# EasyEDA schematic SCH_ESP8266_2025-01-11.json

## Sheets
1 ESP8266
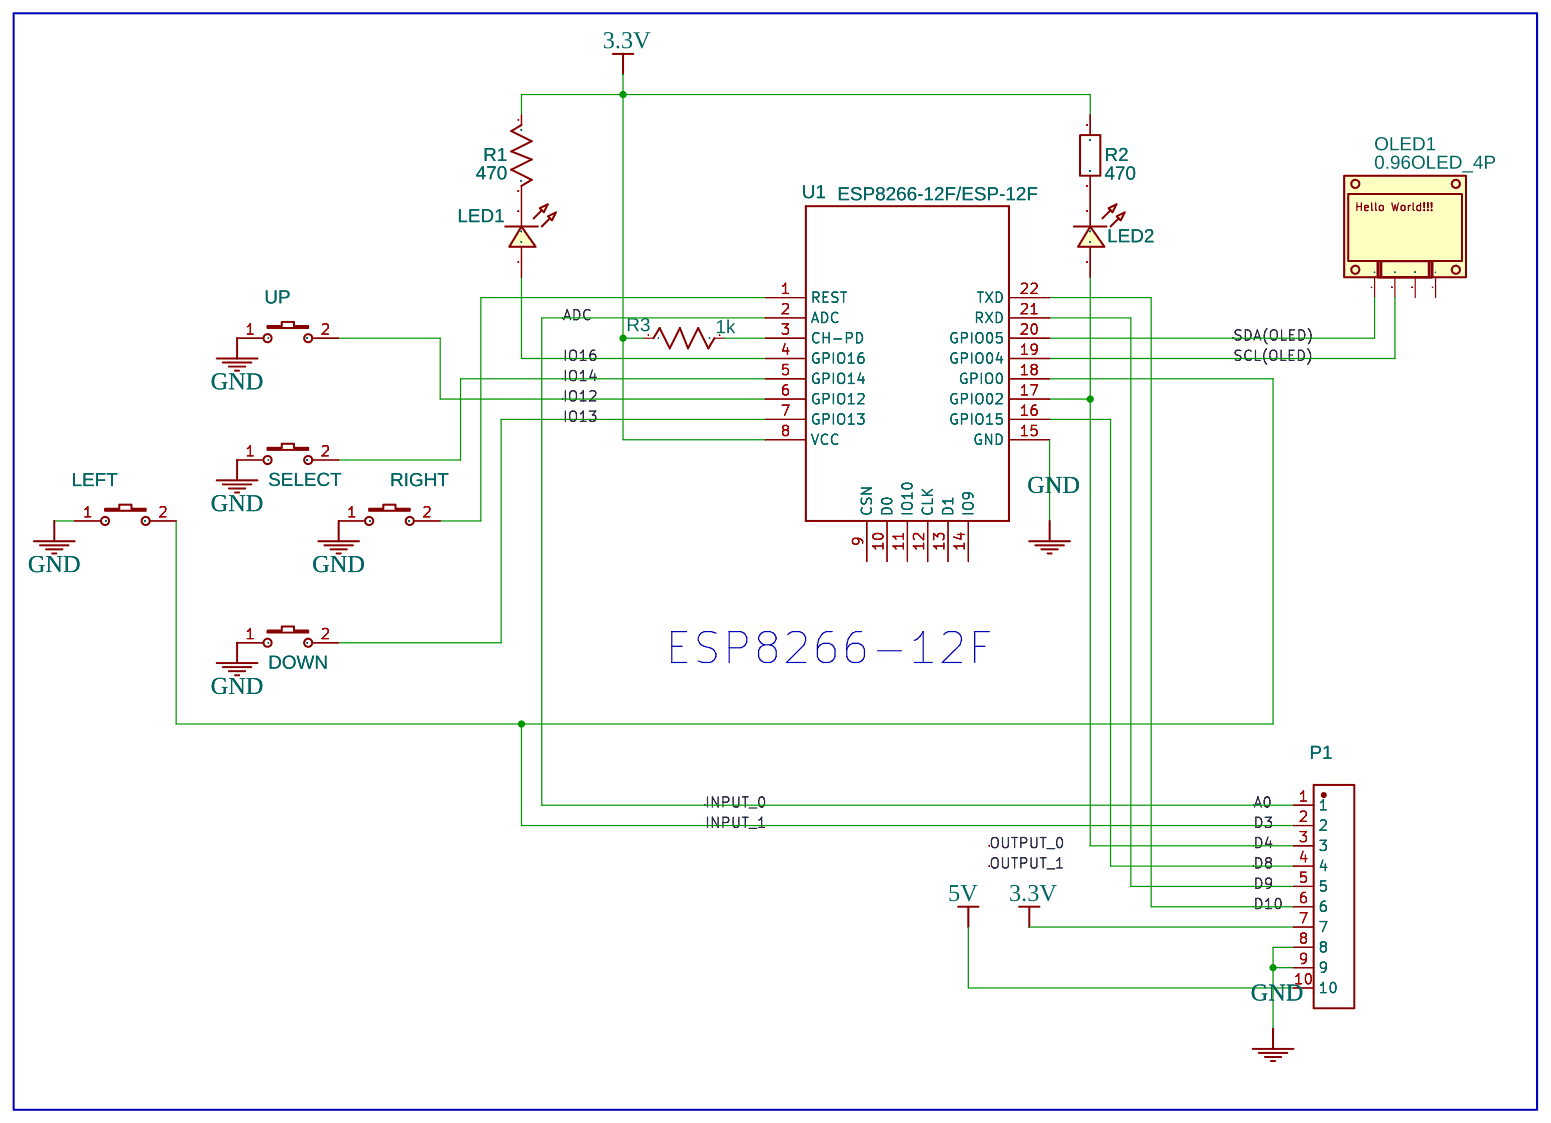
[diagram p0: ESP8266]
2 Peripheral
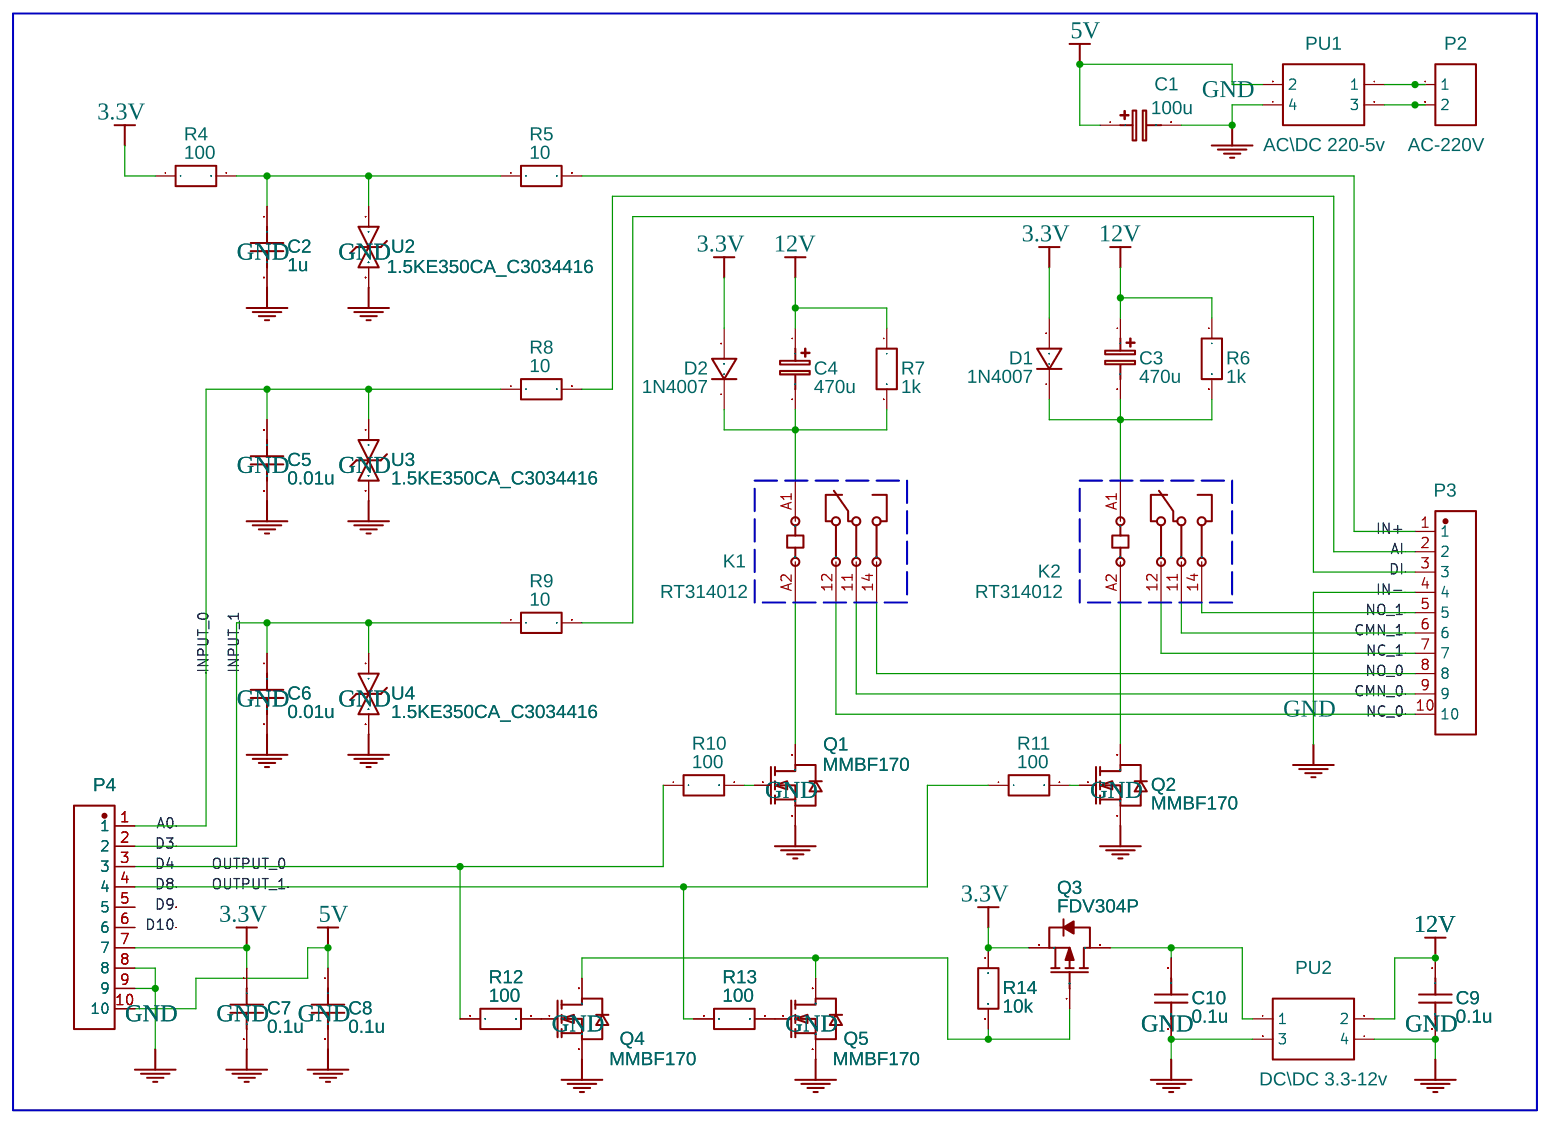
[diagram p1: Peripheral]

## Parts
sheet ESP8266
DOWN  K2-3.6×6.1_SMD  [KEY-SMD_2P-L6.2-W3.6-LS8.0]
LED1  LED-0603_R  [LED0603_RED]
LED2  LED-0603_R  [LED0603_RED]
LEFT  K2-3.6×6.1_SMD  [KEY-SMD_2P-L6.2-W3.6-LS8.0]
OLED1  0.96OLED_4P  [0.96OLED_4P]
P1  MTP310-1110S1  [HDR-TH_10P-P1.27-V-M]
R1  470  [3-0603]
R2  470  [R0603]
R3  1k  [3-0603]
RIGHT  K2-3.6×6.1_SMD  [KEY-SMD_2P-L6.2-W3.6-LS8.0]
SELECT  K2-3.6×6.1_SMD  [KEY-SMD_2P-L6.2-W3.6-LS8.0]
U1  ESP8266-12F/ESP-12F  [LGA22-2.0-24X16MM]
UP  K2-3.6×6.1_SMD  [KEY-SMD_2P-L6.2-W3.6-LS8.0]
sheet Peripheral
C1  100u  [CASE-A_3216]
C2  1u  [C0603]
C3  470u  [CASE-A_3216]
C4  470u  [CASE-A_3216]
C5  0.01u  [C0603]
C6  0.01u  [C0603]
C7  0.1u  [C0603]
C8  0.1u  [C0603]
C9  0.1u  [C0603]
C10  0.1u  [C0603]
D1  1N4007  [DO-41_BD2.4-L4.7-P8.70-D0.9-RD]
D2  1N4007  [DO-41_BD2.4-L4.7-P8.70-D0.9-RD]
K1  RT314012  [RELAY-TH_RT314012F]
K2  RT314012  [RELAY-TH_RT314012F]
P2  AC-220V  [CONN-TH_2P-P5.00]
P3  MTP310-1110S1  [HDR-TH_10P-P1.27-V-M]
P4  MTP310-1110S1  [HDR-TH_10P-P1.27-V-M]
PU1  AC\DC 220-5v  [HDR-M-2.54_2X2]
PU2  DC\DC 3.3-12v  [HDR-M-2.54_2X2]
Q1  MMBF170  [SOT-23-3_L2.9-W1.3-P1.90-LS2.4-BR]
Q2  MMBF170  [SOT-23-3_L2.9-W1.3-P1.90-LS2.4-BR]
Q3  FDV304P  [SOT-23-3_L2.9-W1.3-P1.90-LS2.4-BR]
Q4  MMBF170  [SOT-23-3_L2.9-W1.3-P1.90-LS2.4-BR]
Q5  MMBF170  [SOT-23-3_L2.9-W1.3-P1.90-LS2.4-BR]
R4  100  [R0603]
R5  10  [R0603]
R6  1k  [R0603]
R7  1k  [R0603]
R8  10  [R0603]
R9  10  [R0603]
R10  100  [R0603]
R11  100  [R0603]
R12  100  [R0603]
R13  100  [R0603]
R14  10k  [R0603]
U2  1.5KE350CA_C3034416  [DIO-TH_BD5.1-L8.4-P12.40-D1.0-BI]
U3  1.5KE350CA_C3034416  [DIO-TH_BD5.1-L8.4-P12.40-D1.0-BI]
U4  1.5KE350CA_C3034416  [DIO-TH_BD5.1-L8.4-P12.40-D1.0-BI]

## Library data of the parts
DOWN LEFT RIGHT SELECT UP = K2-3.6×6.1_SMD: Supplier Part: C118141; Supplier: LCSC; Manufacturer Part: K2-1107ST-A4SW-06; Contributor: LCEDA_Lib; 制造商: 韩国韩荣
LED1 LED2 = LED-0603_R: Manufacturer: EVERLIGHT(台湾亿光); Manufacturer Part: 19-217/R6C-AL1M2VY/3T; Supplier Part: C72044; Supplier: LCSC; Contributor: LCEDA_01
OLED1 = 0.96OLED_4P: Supplier: LCSC; Contributor: LCEDA_Lib
P1 P3 P4 = MTP310-1110S1: Contributor: lcsc; Supplier: LCSC; Supplier Part: C5142353; Manufacturer: MINTRON(明硕); JLCPCB Part Class: Extended Part
R1 R3 = Resistor: Manufacturer Part: ?
R2 R4-R14 = R_0603_EU: Contributor: LCEDA_Lib
U1 = -: SMD ESP8266 based WiFi module FCC/CE; catid: 20; Supplier: SeeedStudio; SeeedStudio: 317060015; Manufacturer Part: ESP8266-12E/ESP-12E; sourceId: x7jTsOM8S
C1 C3 C4 = C_Tan_SMD_A_EU: Contributor: LCEDA_Lib
C2 C5-C10 = C_0603_US: Contributor: LCEDA_Lib
D1 D2 = 1N4007: Supplier: LCSC; Manufacturer: SEMTECH; Supplier Part: C106903; Contributor: LCEDA_Lib
K1 K2 = RT314012F: Contributor: LCSC; Supplier: LCSC; Supplier Part: C1524714; Manufacturer: TE Connectivity(美国泰科); JLCPCB Part Class: Extended Part
P2 = CONN-TH_2P-P5.00: Supplier: LCSC; Contributor: LCEDA_Lib
PU1 PU2 = HDR-M-2.54_2x2: Supplier Part: C66690; Supplier: LCSC; Contributor: LCEDA_Lib
Q1 Q2 Q4 Q5 = MMBF170Q-13-F: Contributor: lcsc; Supplier: LCSC; Supplier Part: C6673446; Manufacturer: DIODES(美台); JLCPCB Part Class: Extended Part
Q3 = FDV304P_C7419961: Supplier: LCSC; Supplier Part: C7419961; Manufacturer: TECH PUBLIC(台舟); JLCPCB Part Class: Extended Part; Contributor: lcsc
U2-U4 = 1.5KE350CA_C3034416: Contributor: lcsc; Supplier: LCSC; Supplier Part: C3034416; Manufacturer: Liown(里阳半导体); Manufacturer Part: 1.5KE350CA; JLCPCB Part Class: Extended Part

## Nets
3.3V: C7.1 D1.2 D2.2 P1.7 P4.7 Q3.2(S) R1.1 R2.1 R3.1 R4.1 R14.1 U1.8(VCC)
5V: C1.1 C8.1 P1.10 P4.10 PU1.2
12V: C3.1 C4.1 C9.1 PU2.2 R6.1 R7.1
GND: C1.2 C2.2 C5.2 C6.2 C7.2 C8.2 C9.2 C10.1 DOWN.1 LEFT.1 P1.8 P1.9 P3.4 P4.8 P4.9 PU1.4 PU2.3 PU2.4 Q1.2(S) Q2.2(S) Q4.2(S) Q5.2(S) RIGHT.1 SELECT.1 U1.15(GND) U2.2 U3.2 U4.2 UP.1
A0: C5.1 P1.1 P4.1 R8.1 U1.2(ADC) U3.1
AI: P3.2 R8.2
CMN_0: K1.11 P3.9
CMN_1: K2.11 P3.6
D3: C6.1 LEFT.2 P1.2 P4.2 R9.1 U1.18(GPIO0) U4.1
D4: LED2.1 P1.3 P4.3 R10.1 R12.1 U1.17(GPIO02)
D8: P1.4 P4.4 R11.1 R13.1 U1.16(GPIO15)
D9: P1.5 U1.21(RXD)
D10: P1.6 U1.22(TXD)
DI: P3.3 R9.2
IN+: P3.1 R5.2
IO12: U1.6(GPIO12) UP.2
IO13: DOWN.2 U1.7(GPIO13)
IO14: SELECT.2 U1.5(GPIO14)
IO16: LED1.1 U1.4(GPIO16)
NC_0: K1.12 P3.10
NC_1: K2.12 P3.7
NO_0: K1.14 P3.8
NO_1: K2.14 P3.5
SCL(OLED): OLED1.2 U1.19(GPIO04)
SDA(OLED): OLED1.1 U1.20(GPIO05)
Net-(C2-1): C2.1 R4.2 R5.1 U2.1
Net-(C3-2): C3.2 D1.1 K2.A1 R6.2
Net-(C4-2): C4.2 D2.1 K1.A1 R7.2
Net-(C10-2): C10.2 PU2.1 Q3.3(D)
Net-(K1-A2): K1.A2 Q1.3(D)
Net-(K2-A2): K2.A2 Q2.3(D)
Net-(LED1-2): LED1.2 R1.2
Net-(LED2-2): LED2.2 R2.2
Net-(P2-1): P2.1 PU1.1
Net-(P2-2): P2.2 PU1.3
Net-(Q1-1): Q1.1(G) R10.2
Net-(Q2-1): Q2.1(G) R11.2
Net-(Q3-1): Q3.1(G) Q4.3(D) Q5.3(D) R14.2
Net-(Q4-1): Q4.1(G) R12.2
Net-(Q5-1): Q5.1(G) R13.2
Net-(R3-2): R3.2 U1.3(CH-PD)
Net-(RIGHT-2): RIGHT.2 U1.1(REST)

Not connected (* = marked no-connect by the designer): OLED1 3 4; P4 5 6; U1 9(CSN) 10(D0) 11(IO10) 12(CLK) 13(D1) 14(IO9)

## Notes on the sheets
sheet 1
- ESP8266-12F
